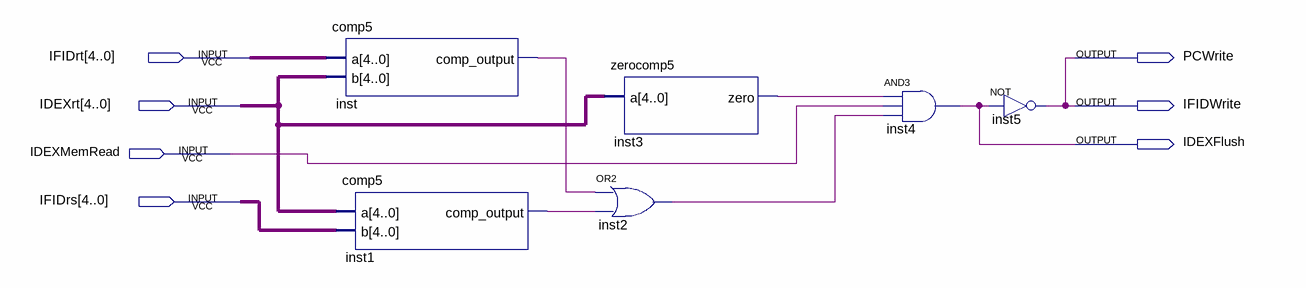
[diagram p0: schematic sheet]
// Quartus schematic HazardDetectionUnit.bdf as structural Verilog: 6 symbols, 7 pins
module HazardDetectionUnit (
  input  [4:0] IFIDrt,
  input  [4:0] IDEXrt,
  input  IDEXMemRead,
  input  [4:0] IFIDrs,
  output PCWrite,
  output IFIDWrite,
  output IDEXFlush
);

  wire inst1_comp_output, inst2_out, inst3_zero, inst_comp_output;

  comp5 inst (.a(IFIDrt), .b(IDEXrt), .comp_output(inst_comp_output));
  comp5 inst1 (.a(IDEXrt), .b(IFIDrs), .comp_output(inst1_comp_output));
  zerocomp5 inst3 (.a(IDEXrt), .zero(inst3_zero));
  or inst2 (inst2_out, inst_comp_output, inst1_comp_output);
  and inst4 (IDEXFlush, inst3_zero, IDEXMemRead, inst2_out);
  not inst5 (IFIDWrite, IDEXFlush);

  assign PCWrite = IFIDWrite;
endmodule
